# EAGLE design rekick001 (EAGLE 4.16)

## Sheet 1 of 2
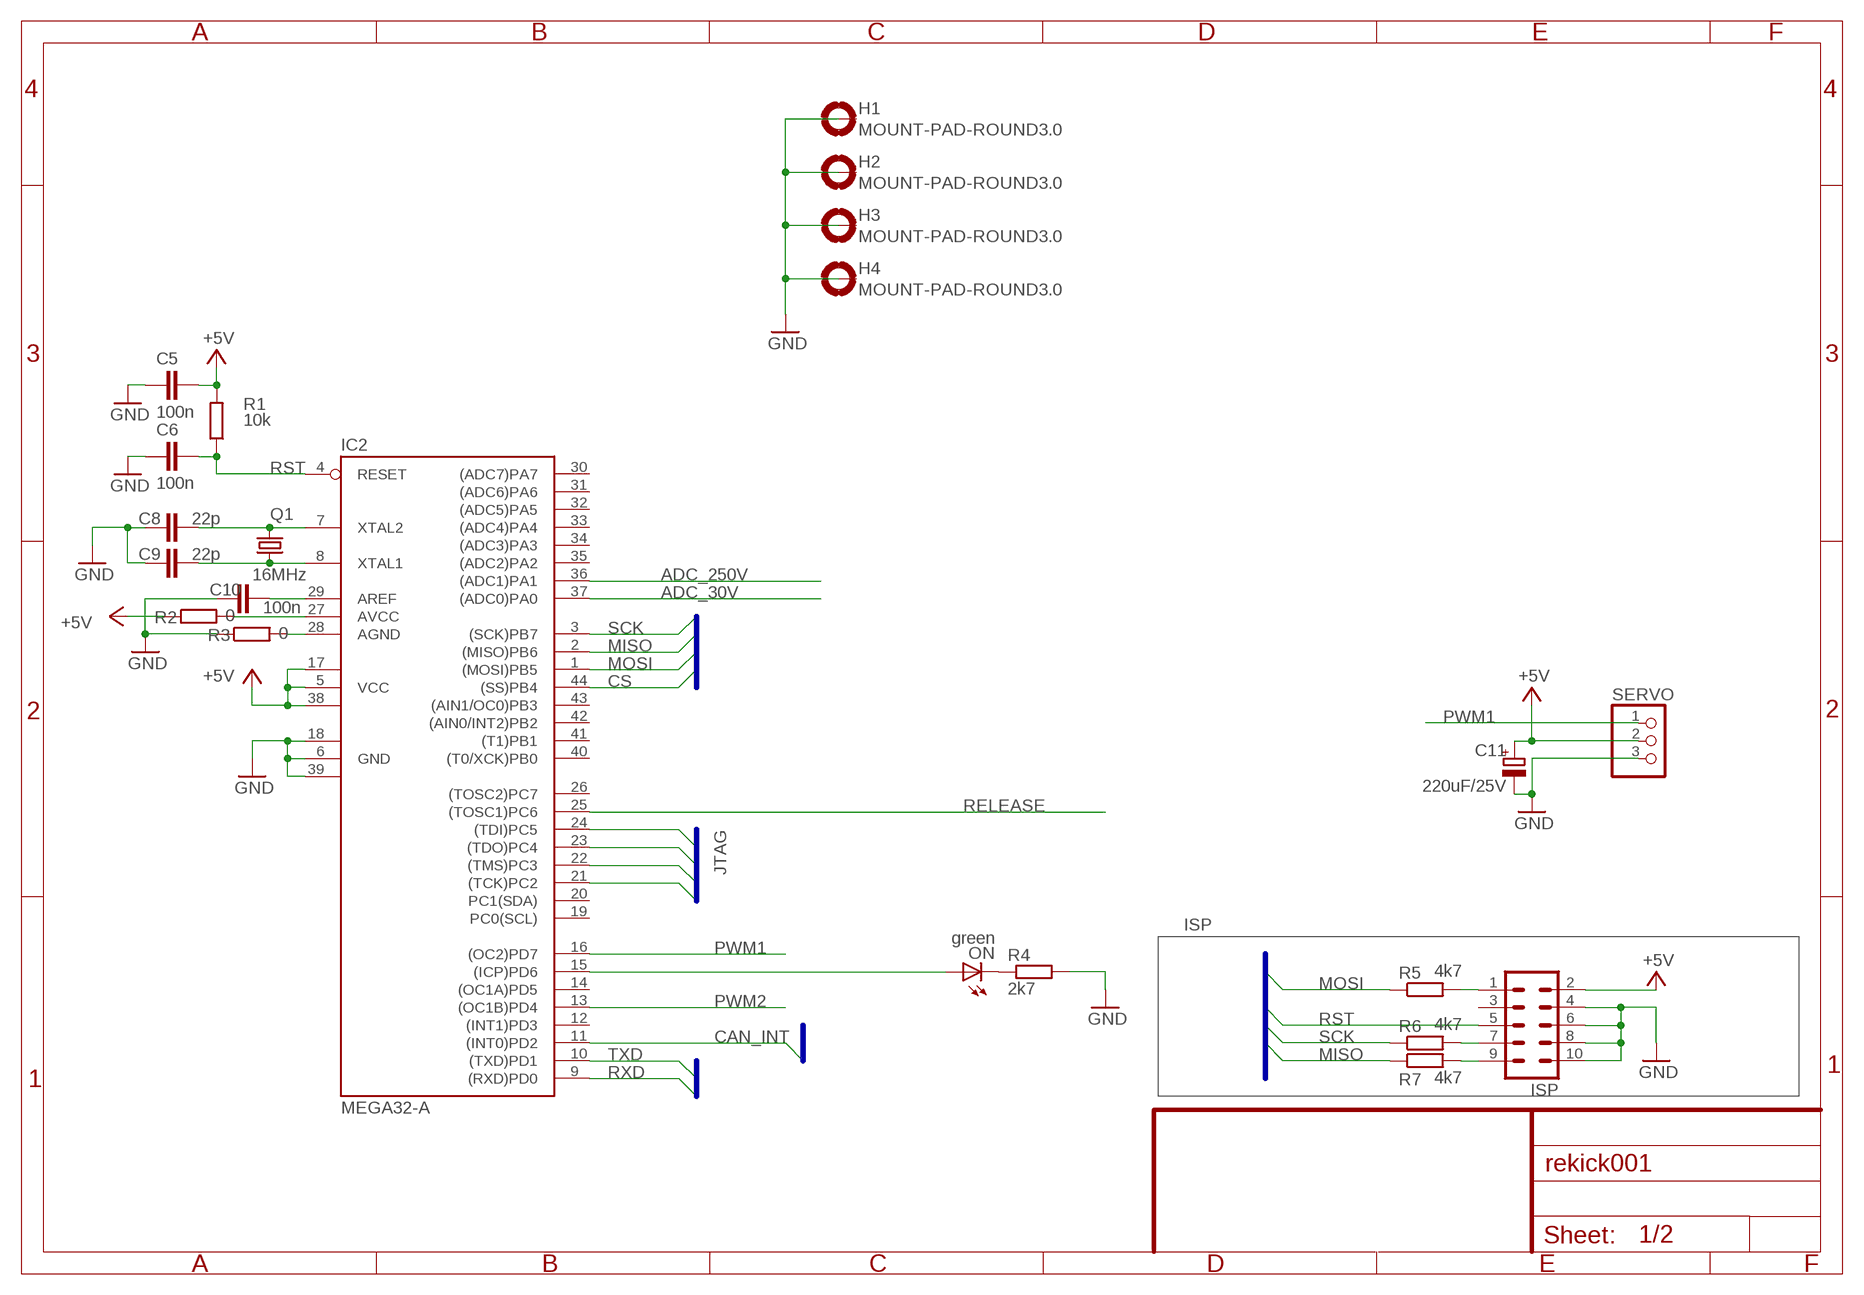
[diagram p0: schematic, sheet 1]

### Parts
C5  100n  C-EUC0603  [C0603]
C6  100n  C-EUC0603  [C0603]
C8  22p  C-EUC0603  [C0603]
C9  22p  C-EUC0603  [C0603]
C10  100n  C-EUC0603  [C0603]
C11  220uF/25V  CPOL-EUE3.5-8  [E3,5-8]
H1  MOUNT-PAD-ROUND3.0  [3,0-PAD]
H2  MOUNT-PAD-ROUND3.0  [3,0-PAD]
H3  MOUNT-PAD-ROUND3.0  [3,0-PAD]
H4  MOUNT-PAD-ROUND3.0  [3,0-PAD]
IC2  MEGA32-A  [TQFP44]
ISP  MA05-2  [MA05-2]
ON  green  LED3MM  [LED3MM]
Q1  16MHz  CRYSTALHC49S  [HC49/S]
R1  10k  R-EU_R0805  [R0805]
R2  0  R-EU_R0805  [R0805]
R3  0  R-EU_R0805  [R0805]
R4  2k7  R-EU_R0805  [R0805]
R5  4k7  R-EU_R0805  [R0805]
R6  4k7  R-EU_R0805  [R0805]
R7  4k7  R-EU_R0805  [R0805]
SERVO  PINHD-1X3  [1X03]

### Nets
+5V [Power]: C5.2 C11.+ IC2.5(VCC) IC2.17(VCC1) IC2.38(VCC2) ISP.2 R1.2 R2.1 SERVO.2 ; also sheet 2
ADC_30V: IC2.37((ADC0)PA0)
ADC_250V: IC2.36((ADC1)PA1)
CAN_INT: IC2.11((INT0)PD2) ; also sheet 2
CS: IC2.44((SS)PB4) ; also sheet 2
GND [Power]: C5.1 C6.1 C8.1 C9.2 C10.1 C11.- H1.B3,0(MOUNT) H2.B3,0(MOUNT) H3.B3,0(MOUNT) H4.B3,0(MOUNT) IC2.6(GND) IC2.18(GND1) IC2.39(GND2) ISP.4 ISP.6 ISP.8 ISP.10 R3.1 R4.2 SERVO.3 ; also sheet 2
MISO: IC2.2((MISO)PB6) R7.1 ; also sheet 2
MOSI: IC2.1((MOSI)PB5) R5.1 ; also sheet 2
N$1: IC2.15((ICP)PD6) ON.A
N$2: C10.2 IC2.29(AREF)
N$3: IC2.27(AVCC) R2.2
N$4: C9.1 IC2.8(XTAL1) Q1.1
N$5: C8.2 IC2.7(XTAL2) Q1.2
N$6: ISP.1 R5.2
N$7: IC2.28(AGND) R3.2
N$8: ISP.7 R6.2
N$9: ISP.9 R7.2
N$31: ON.K(C) R4.1
PWM1: IC2.16((OC2)PD7) SERVO.1
PWM2: IC2.13((OC1B)PD4)
RELEASE: IC2.25((TOSC1)PC6) ; also sheet 2
RST: C6.2 IC2.4(RESET) ISP.5 R1.1 ; also sheet 2
RXD: IC2.9((RXD)PD0)
SCK: IC2.3((SCK)PB7) R6.1 ; also sheet 2
TCK: IC2.21((TCK)PC2)
TDI: IC2.24((TDI)PC5)
TDO: IC2.23((TDO)PC4)
TMS: IC2.22((TMS)PC3)
TXD: IC2.10((TXD)PD1)
Unconnected: IC2.12((INT1)PD3) IC2.14((OC1A)PD5) IC2.19(PC0(SCL)) IC2.20(PC1(SDA)) IC2.26((TOSC2)PC7) IC2.30((ADC7)PA7) IC2.31((ADC6)PA6) IC2.32((ADC5)PA5) IC2.33((ADC4)PA4) IC2.34((ADC3)PA3) IC2.35((ADC2)PA2) IC2.40((T0/XCK)PB0) IC2.41((T1)PB1) IC2.42((AIN0/INT2)PB2) IC2.43((AIN1/OC0)PB3) ISP.3

### Buses
MISO,MOSI,SCK,RST
CS,MOSI,MISO,SCK
RXD,TXD
TDI,TDO,TMS,TCK
CAN_INT

### Notes on the sheet
- JTAG
- ISP

## Sheet 2 of 2
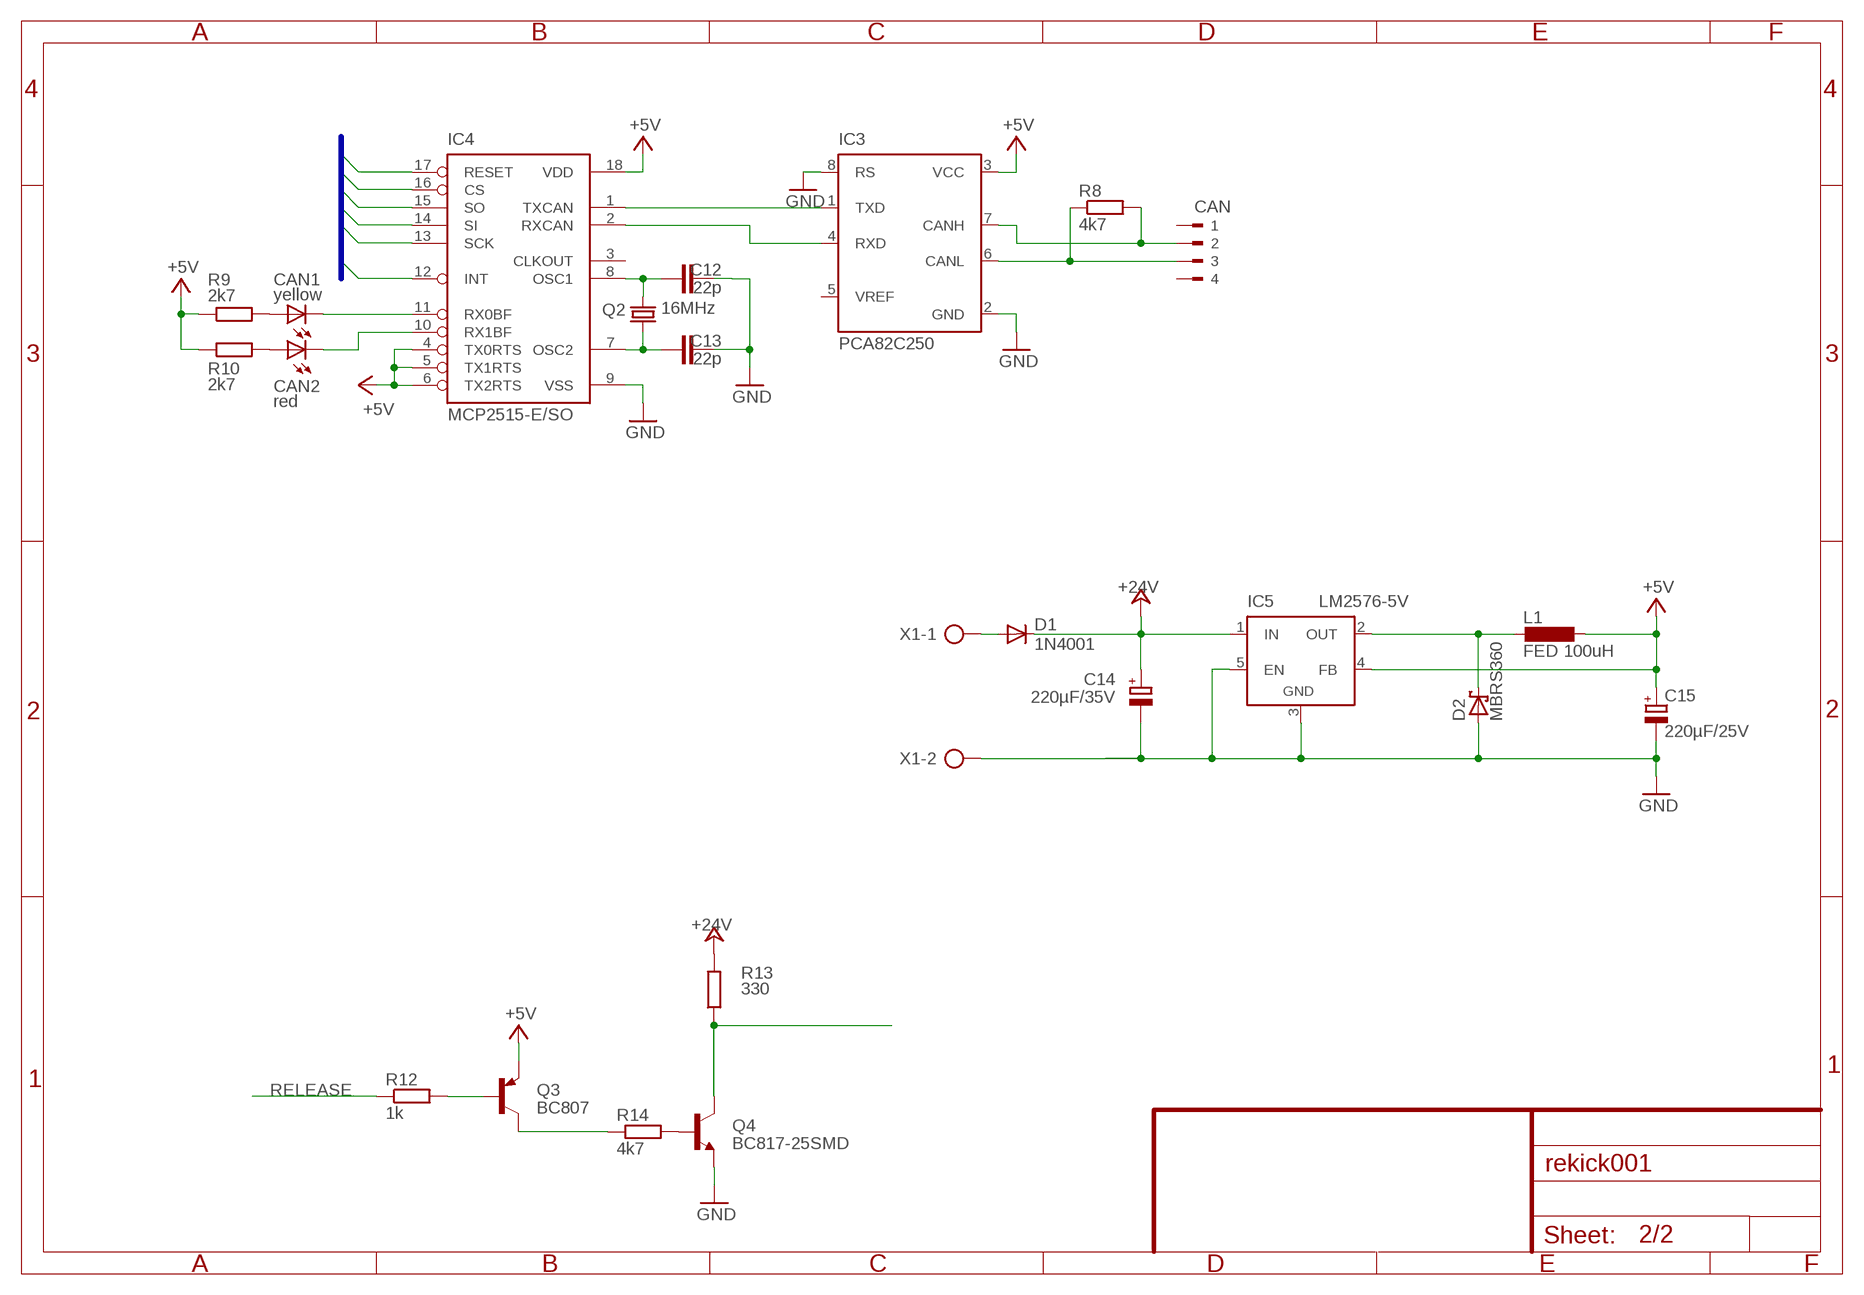
[diagram p1: schematic, sheet 2]

### Parts
C12  22p  C-EUC0603  [C0603]
C13  22p  C-EUC0603  [C0603]
C14  220µF/35V  CPOL-EUE5-10.5  [E5-10,5]
C15  220µF/25V  CPOL-EUE3.5-10  [E3,5-10]
CAN  90-4  [90-4]
CAN1  yellow  LED3MM  [LED3MM]
CAN2  red  LED3MM  [LED3MM]
D1  1N4001  1N4004  [DO41-10]
D2  MBRS360  SCHOTTKY-DIODESMD  [SMB]
IC3  PCA82C250  [DIL08]
IC4  MCP2515-E/SO  [SO18L]
IC5  LM2576-5V  LM2596TV  [TO220-51]
L1  FED 100uH  L-EUTJ4-U1  [TJ4-U1]
Q2  16MHz  CRYSTALHC49U-V  [HC49U-V]
Q3  BC807  BC807-40SMD  [SOT23-BEC]
Q4  BC817-25SMD  [SOT23-BEC]
R8  4k7  R-EU_R0805  [R0805]
R9  2k7  R-EU_R0805  [R0805]
R10  2k7  R-EU_R0805  [R0805]
R12  1k  R-EU_R0805  [R0805]
R13  330  R-EU_R0805  [R0805]
R14  4k7  R-EU_R0805  [R0805]
X1  AK500/2-H  [AK500/2-H]

### Nets
+5V [Power]: C15.+ IC3.3(VCC) IC4.4(TX0RTS) IC4.5(TX1RTS) IC4.6(TX2RTS) IC4.18(VDD) IC5.4(FB) L1.1 Q3.E R9.1 R10.1 ; also sheet 1
+24V [Power]: C14.+ D1.C IC5.1(IN) R13.2
CAN_INT: IC4.12(INT) ; also sheet 1
CS: IC4.16(CS) ; also sheet 1
GND [Power]: C12.2 C13.2 C14.- C15.- D2.A IC3.2(GND) IC3.8(RS) IC4.9(VSS) IC5.3(GND) IC5.5(EN) Q4.E X1.2 ; also sheet 1
MISO: IC4.15(SO) ; also sheet 1
MOSI: IC4.14(SI) ; also sheet 1
N$10: CAN1.A R9.2
N$11: CAN2.A R10.2
N$12: IC3.1(TXD) IC4.1(TXCAN)
N$21: Q3.C R14.1
N$22: IC3.4(RXD) IC4.2(RXCAN)
N$23: Q4.B R14.2
N$24: CAN.3 IC3.6(CANL) R8.1
N$25: Q3.B R12.2
N$26: D1.A X1.1
N$27: CAN1.K(C) IC4.11(RX0BF)
N$29: Q4.C R13.1
N$30 [Power]: D2.C IC5.2(OUT) L1.2
N$38: CAN2.K(C) IC4.10(RX1BF)
N$53: C13.1 IC4.7(OSC2) Q2.1
N$54: C12.1 IC4.8(OSC1) Q2.2
N$59: CAN.2 IC3.7(CANH) R8.2
RELEASE: R12.1 ; also sheet 1
RST: IC4.17(RESET) ; also sheet 1
SCK: IC4.13(SCK) ; also sheet 1
Unconnected: CAN.1 CAN.4 IC3.5(VREF) IC4.3(CLKOUT)

### Buses
SCK,MOSI,MISO,RST,CS,CAN_INT

## Library data of the parts
C5 C6 C8-C10 C12 C13 = rcl:C-EU: CAPACITOR, European symbol
C11 C14 C15 = rcl:CPOL-EU: POLARIZED CAPACITOR, European symbol
CAN = con-weidmueller-sl35:90-4: WEIDMUELLER CLAMP CONNECTOR
CAN1 CAN2 ON = led:LED: LED OSRAM: - CHIPLED LG R971, LG N971, LY N971, LG Q971, LY Q971, LO R971, LY R971 LH N974, LH R974 LS Q976, LO Q976, LY Q976 LO Q996 - Hyper CHIPLED LW Q18S LB Q993, LB Q99A, LB R99A - SideLED LS A670, LO A670, LY A670, LG A670, LP A670 LB A673, LV A673, LT A673, LW A673 LH A674 LY A675 LS A676, LA A676, LO A676, LY A676, LW A676 LS A679, LY A679, LG A679 - Hyper Micro SIDELED® LS Y876, LA Y876, LO Y876, LY Y876 LT Y87S - SmartLED LW L88C, LW L88S LB L89C, LB L89S, LG L890 LS L89K, LO L89K, LY L89K LS L896, LA L896, LO L896, LY L896 - TOPLED LS T670, LO T670, LY T670, LG T670, LP T670 LSG T670, LSP T670, LSY T670, LOP T670, LYG T670 LG T671, LOG T671, LSG T671 LB T673, LV T673, LT T673, LW T673 LH T674 LS T676, LA T676, LO T676, LY T676, LB T676, LH T676, LSB T676, LW T676 LB T67C, LV T67C, LT T67C, LS T67K, LO T67K, LY T67K, LW E67C LS E67B, LA E67B, LO E67B, LY E67B, LB E67C, LV E67C, LT E67C LW T67C LS T679, LY T679, LG T679 LS T770, LO T770, LY T770, LG T770, LP T770 LB T773, LV T773, LT T773, LW T773 LH T774 LS E675, LA E675, LY E675, LS T675 LS T776, LA T776, LO T776, LY T776, LB T776 LHGB T686 LT T68C, LB T68C - Hyper Mini TOPLED® LB M676 - Mini TOPLED Santana® LG M470 LS M47K, LO M47K, LY M47K Source: http://www.osram.convergy.de - LUMILED® LXK2-PW12-R00, LXK2-PW12-S00, LXK2-PW14-U00, LXK2-PW14-V00 LXK2-PM12-R00, LXK2-PM12-S00, LXK2-PM14-U00 LXK2-PE12-Q00, LXK2-PE12-R00, LXK2-PE12-S00, LXK2-PE14-T00, LXK2-PE14-U00 LXK2-PB12-K00, LXK2-PB12-L00, LXK2-PB12-M00, LXK2-PB14-N00, LXK2-PB14-P00, LXK2-PB14-Q00 LXK2-PR12-L00, LXK2-PR12-M00, LXK2-PR14-Q00, LXK2-PR14-R00 LXK2-PD12-Q00, LXK2-PD12-R00, LXK2-PD12-S00 LXK2-PH12-R00, LXK2-PH12-S00 LXK2-PL12-P00, LXK2-PL12-Q00, LXK2-PL12-R00 Source: www.luxeon.com
D1 = diode:1N4004: DIODE general purpose rectifier, 1 A
D2 = diode:SCHOTTKY-DIODE: Schottky Diode
H1-H4 = holes:MOUNT-PAD-ROUND: MOUNTING PAD, round
IC2 = atmel:MEGA32: MICROCONTROLLER 32 Kbytes FLASH 2 Kbytes SRAM 1 Kbytes EEPROM USART 8-channel 10 bit ADC Source: www.atmel.com .. doc2503.pdf
IC3 = micro-philips:PCA82C250: CAN CONTROLLER INTERFACE
IC4 = mcp2515:MCP2515
IC5 = linear:LM2596T: STEP-DOWN VOLTAGE REGULATOR
ISP = con-lstb:MA05-2: PIN HEADER
L1 = rcl:L-EU: INDUCTOR, European symbol
Q1 Q2 = crystal:CRYSTAL: CRYSTAL
Q3 = transistor-pnp:BC807*: PNP Transistror
Q4 = transistor-npn:BC817*: NPN Transistor
R1-R10 R12-R14 = rcl:R-EU_: RESISTOR, European symbol
SERVO = pinhead:PINHD-1X3: PIN HEADER
X1 = con-ptr500:AK500/2-H: CONNECTOR Aug. 2004 / PTR Meßtechnik: Die Bezeichnung der Serie AK505 wurde geändert. Es handelt sich hierbei um AK500 in horizontaler Ausführung.

## Net classes
1 Power: width 0.406 mm
2 High Power: width 2 mm

## Board
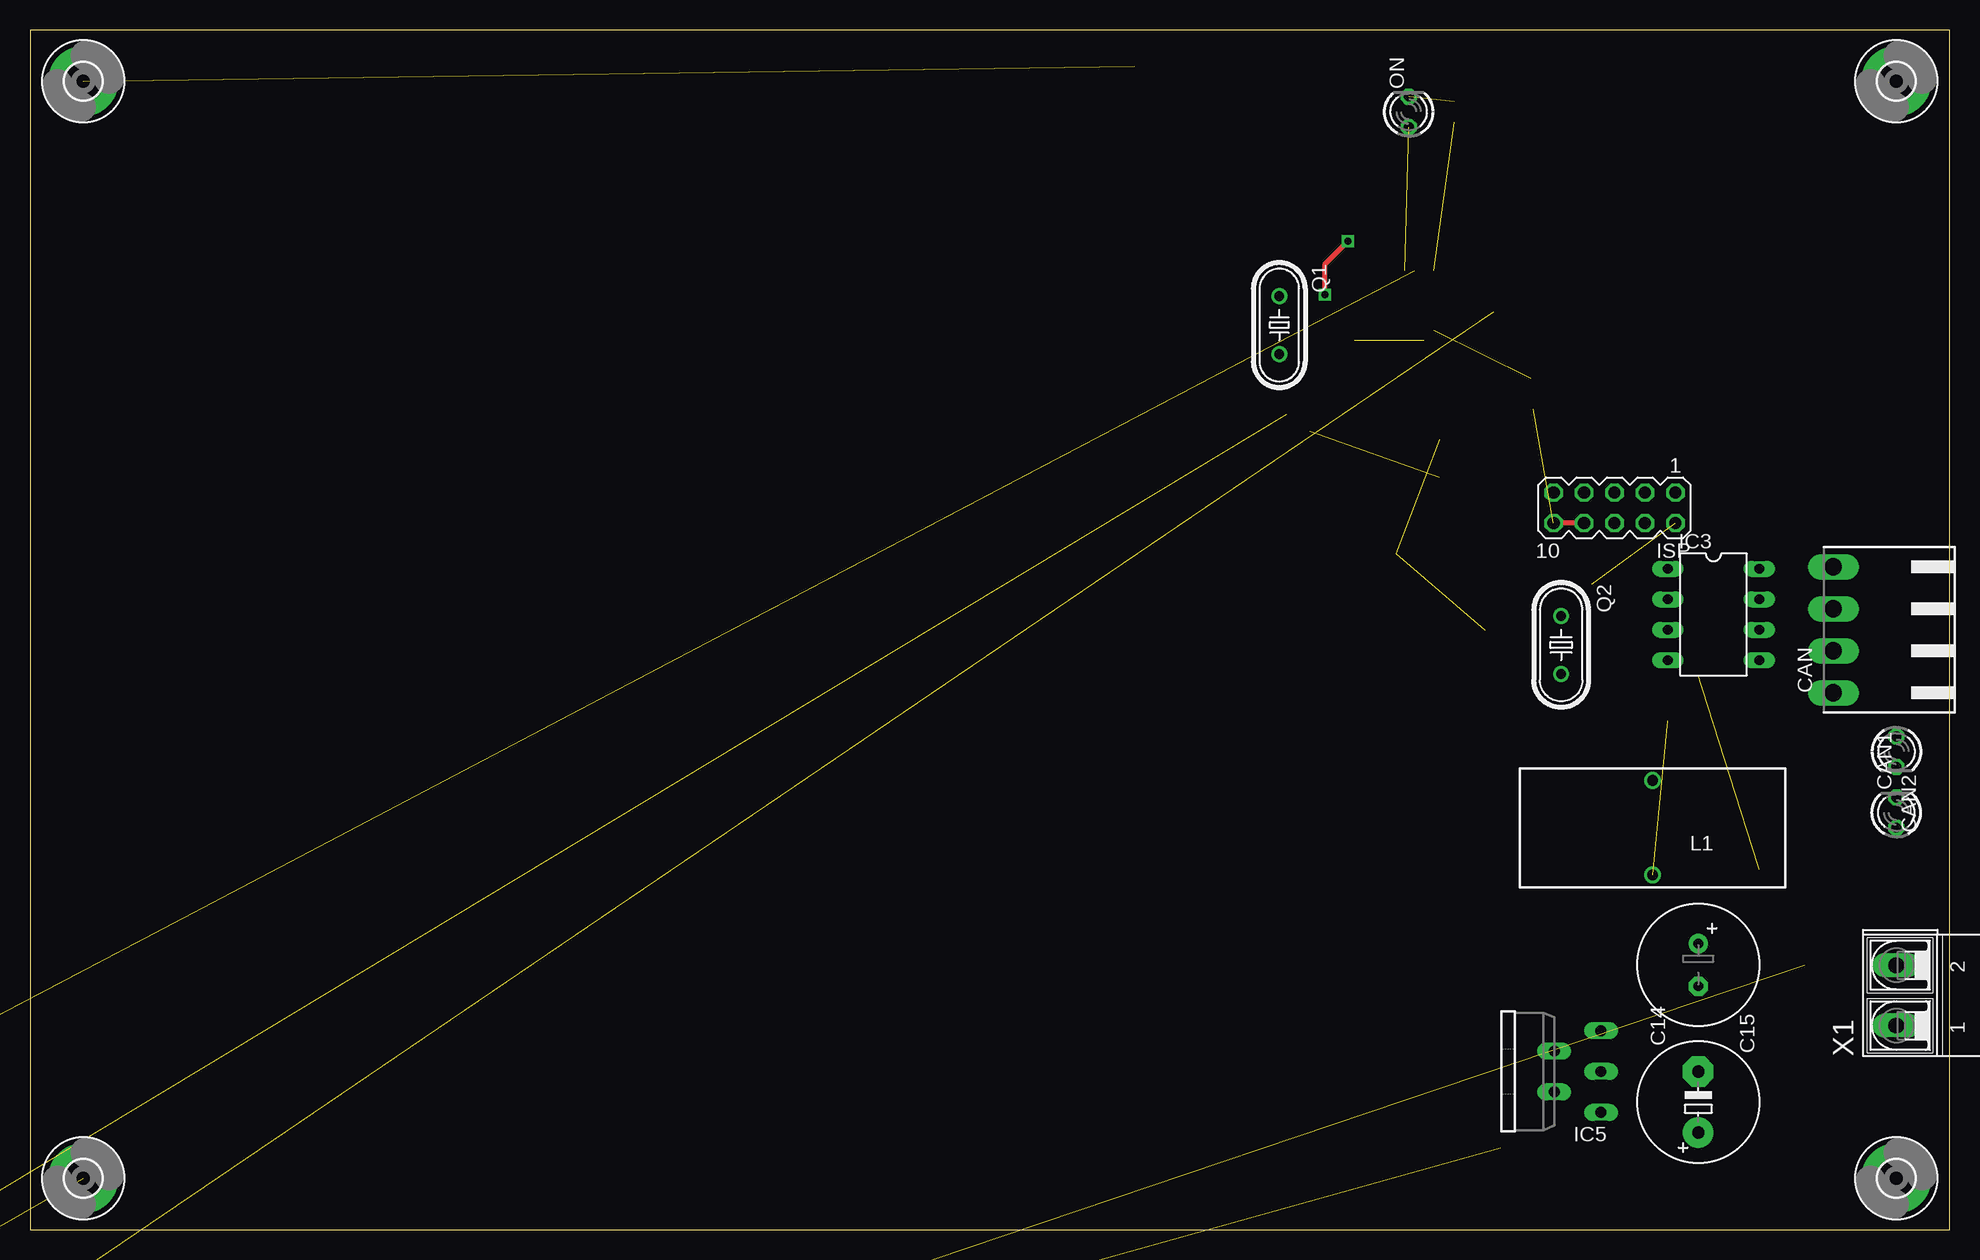
[diagram p2: board, top side]
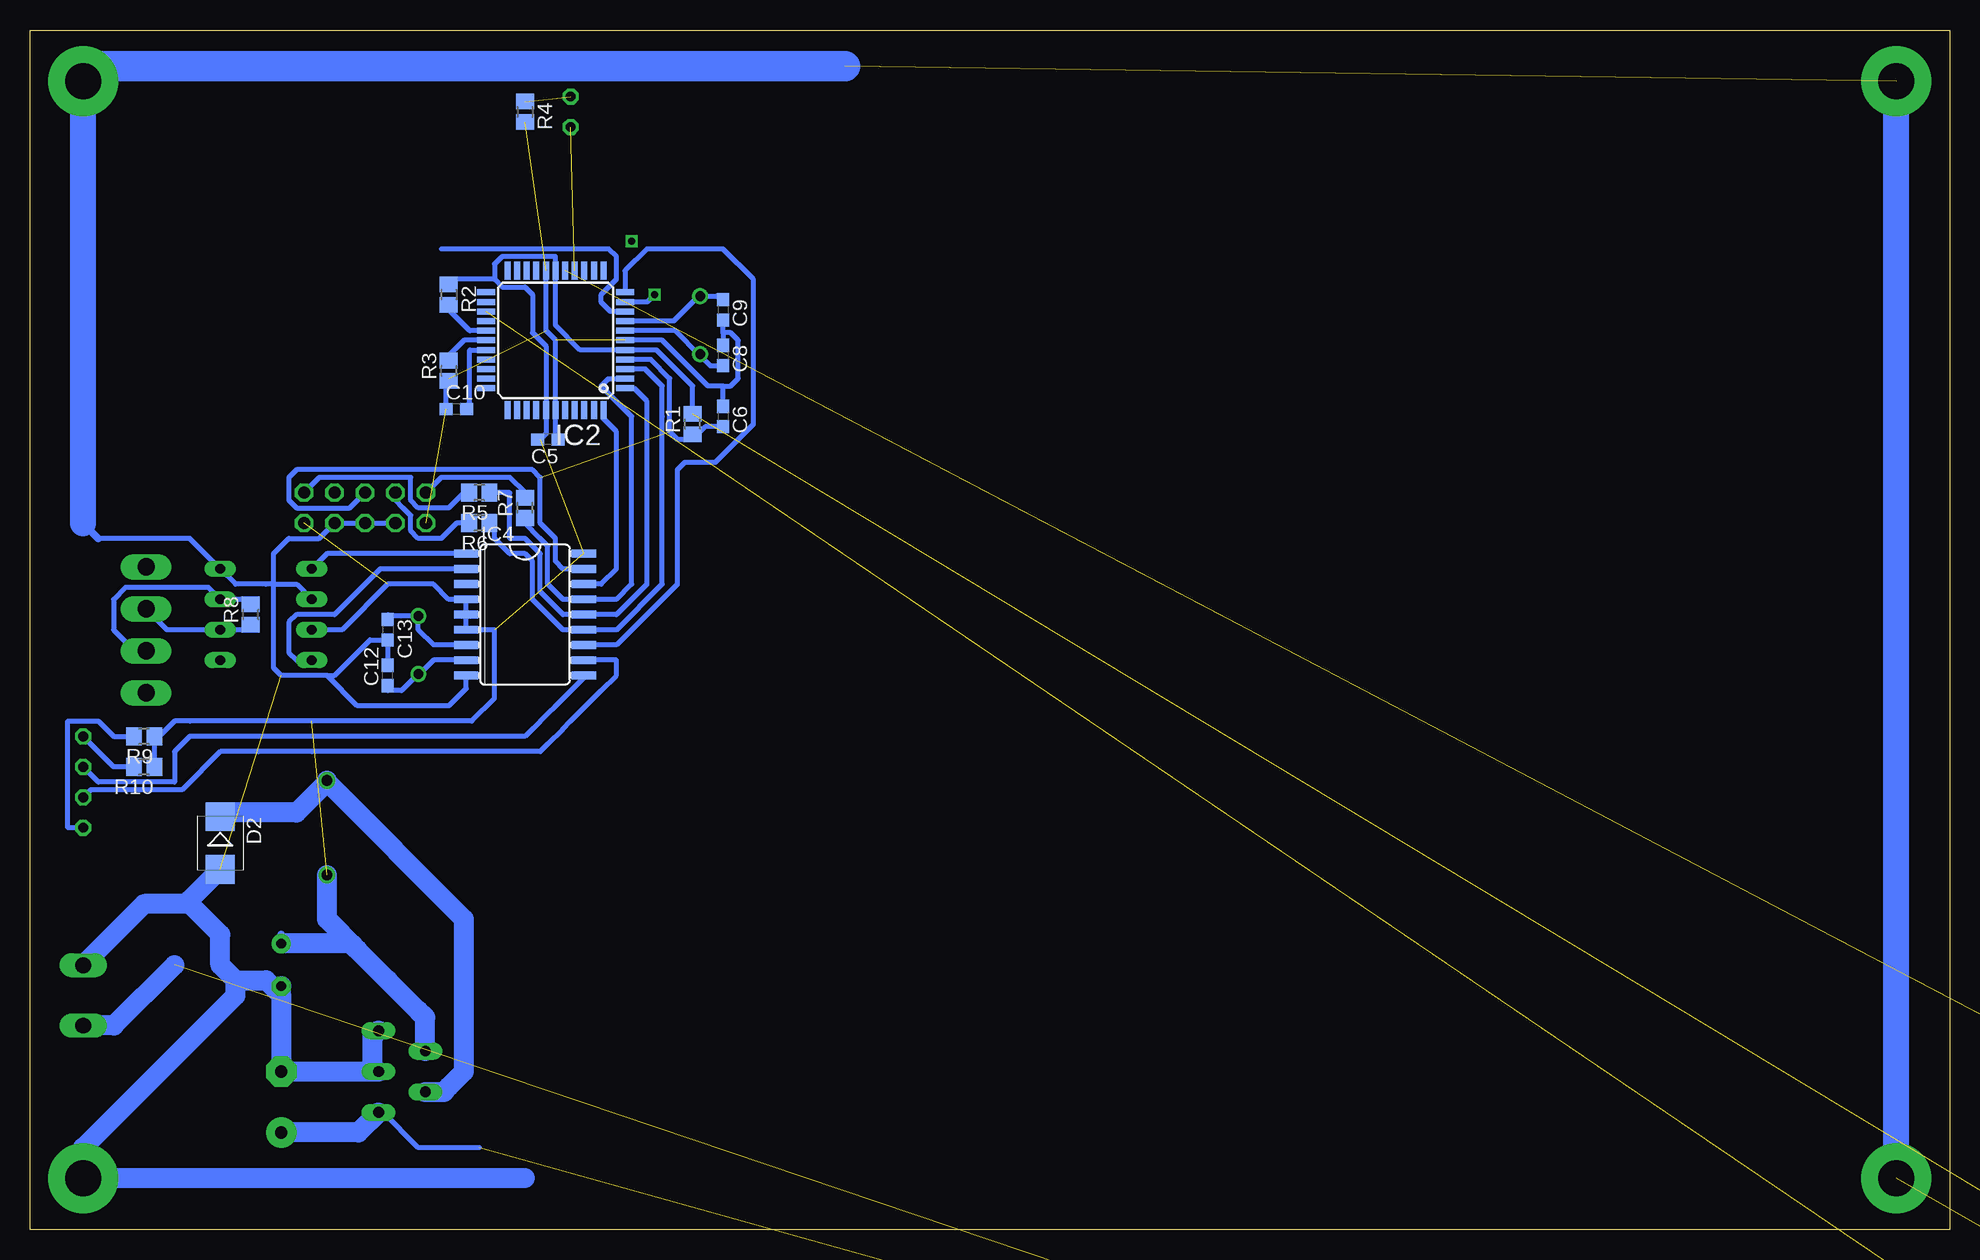
[diagram p3: board, bottom side, seen from below]

Size 160 x 100 mm. Coordinates in mm from the lower left corner, seen from the top.
Outline: 0,0 160,0 160,100 0,100 0,0
Copper layers (1*16): Top 0.035mm / dielectric 1.5mm / Bottom 0.035mm
Design rules "olimex_8mils": minimum track width 10mil, minimum drill 24mil, track to track 8mil, track to pad 8mil, pad to pad 8mil, via to via 8mil, smd to smd 8mil, copper to edge 40mil, drill to drill 10mil, minimum pad ring 10mil, minimum via ring 8mil, stop-mask expansion 0mil, vias tented up to drill 0mil, thermal gap 10mil

### Footprints (pad centres in the part's own frame; a part is rotated, then mirrored left to right if it is on the bottom)
C0603 = smd 1.1 x 1: 1 -0.85,0; 2 0.85,0
E3,5-8 = drill 0.813 pad 1.6 round: + -1.778,0 | drill 0.813 pad 1.6 octagon: - 1.778,0
E5-10,5 = drill 1.016 pad 2.54 round: + -2.54,0 | drill 1.016 pad 2.54 octagon: - 2.54,0
E3,5-10 = drill 0.813 pad 1.6 round: + -1.778,0 | drill 0.813 pad 1.6 octagon: - 1.778,0
90-4 = drill 1.422 long: 1 -5.25,5.25; 2 -1.75,5.25; 3 1.75,5.25; 4 5.25,5.25
LED3MM = drill 0.813 octagon: A -1.27,0; K 1.27,0
DO41-10 = drill 1.118 round: A 5.08,0; C -5.08,0
SMB = smd 2.4 x 2.4: A 2.2,0; C -2.2,0
3,0-PAD = drill 3 pad 5.842 round: B3,0 0,0
TQFP44 = smd 1.5 x 0.5: 1 -5.8,4; 2 -5.8,3.2; 3 -5.8,2.4; 4 -5.8,1.6; 5 -5.8,0.8; 6 -5.8,0; 7 -5.8,-0.8; 8 -5.8,-1.6; 9 -5.8,-2.4; 10 -5.8,-3.2; 11 -5.8,-4; 23 5.8,-4; 24 5.8,-3.2; 25 5.8,-2.4; 26 5.8,-1.6; 27 5.8,-0.8; 28 5.8,0; 29 5.8,0.8; 30 5.8,1.6; 31 5.8,2.4; 32 5.8,3.2; 33 5.8,4 | smd 0.5 x 1.5: 12 -4,-5.8; 13 -3.2,-5.8; 14 -2.4,-5.8; 15 -1.6,-5.8; 16 -0.8,-5.8; 17 0,-5.8; 18 0.8,-5.8; 19 1.6,-5.8; 20 2.4,-5.8; 21 3.2,-5.8; 22 4,-5.8; 34 4,5.8; 35 3.2,5.8; 36 2.4,5.8; 37 1.6,5.8; 38 0.8,5.8; 39 0,5.8; 40 -0.8,5.8; 41 -1.6,5.8; 42 -2.4,5.8; 43 -3.2,5.8; 44 -4,5.8
DIL08 = drill 0.813 long: 1 -3.81,-3.81; 2 -1.27,-3.81; 3 1.27,-3.81; 4 3.81,-3.81; 5 3.81,3.81; 6 1.27,3.81; 7 -1.27,3.81; 8 -3.81,3.81
SO18L = smd 0.66 x 2.032: 1 -5.08,-4.902; 2 -3.81,-4.902; 3 -2.54,-4.902; 4 -1.27,-4.902; 5 0,-4.902; 6 1.27,-4.902; 7 2.54,-4.902; 8 3.81,-4.902; 9 5.08,-4.902; 10 5.08,4.902; 11 3.81,4.902; 12 2.54,4.902; 13 1.27,4.902; 14 0,4.902; 15 -1.27,4.902; 16 -2.54,4.902; 17 -3.81,4.902; 18 -5.08,4.902
TO220-51 = drill 0.9 long: 1 -3.4,-8.4; 2 -1.7,-4.5; 3 0,-8.4; 4 1.7,-4.5; 5 3.4,-8.4
MA05-2 = drill 1.016 octagon: 1 -5.08,-1.27; 2 -5.08,1.27; 3 -2.54,-1.27; 4 -2.54,1.27; 5 0,-1.27; 6 0,1.27; 7 2.54,-1.27; 8 2.54,1.27; 9 5.08,-1.27; 10 5.08,1.27
TJ4-U1 = drill 0.9 round: 1 -3.935,0; 2 3.935,0
HC49/S = drill 0.813 round: 1 -2.413,0; 2 2.413,0
HC49U-V = drill 0.813 round: 1 -2.413,0; 2 2.413,0
SOT23-BEC = smd 1 x 1.4: B -0.95,-1.1; C 0,1.1; E 0.95,-1.1
R0805 = smd 1.3 x 1.5: 1 -0.85,0; 2 0.85,0
1X03 = drill 1.016 long: 1 -2.54,0; 2 0,0; 3 2.54,0
AK500/2-H = drill 1.321 long: 1 -2.515,0; 2 2.515,0

### Placement (x,y rotation side)
C5  116.83,65.88 180 bottom
C6  102.23,67.78 270 bottom
C8  102.23,72.86 270 bottom
C9  102.23,76.67 270 bottom
C10  124.45,68.41 0 bottom
C11  -34.93,-17.31 0 top  (outside the outline)
C12  130.17,46.19 90 bottom
C13  130.17,50 270 bottom
C14  139.06,10.63 90 top
C15  139.06,22.06 270 top
CAN  155.57,50 90 top
CAN1  155.57,34.76 90 top
CAN2  155.57,39.84 270 top
D1  -45.09,-41.44 0 top  (outside the outline)
D2  144.14,32.22 270 bottom
H1  4.44,95.72 0 top
H2  4.44,4.28 0 top
H3  155.57,95.72 0 top
H4  155.57,4.28 0 top
IC2  116.2,74.13 180 bottom
IC3  140.33,51.27 270 top
IC4  118.74,51.27 270 bottom
IC5  122.55,13.17 90 top
ISP  132.07,60.16 180 top
L1  135.25,33.49 90 top
ON  114.93,93.18 90 top
Q1  104.13,75.4 270 top
Q2  127.63,48.73 270 top
Q3  -40.64,-26.2 0 top  (outside the outline)
Q4  -31.12,-26.2 0 top  (outside the outline)
R1  104.77,67.14 90 bottom
R2  125.09,77.94 270 bottom
R3  125.09,71.59 90 bottom
R4  118.74,93.18 270 bottom
R5  122.55,61.43 180 bottom
R6  122.55,58.89 180 bottom
R7  118.74,60.16 90 bottom
R8  141.6,51.27 90 bottom
R9  150.49,41.11 180 bottom
R10  150.49,38.57 180 bottom
R12  -40.64,-34.45 0 top  (outside the outline)
R13  -50.17,-56.68 0 top  (outside the outline)
R14  -31.75,-34.45 0 top  (outside the outline)
SERVO  -50.17,-8.42 0 top  (outside the outline)
X1  155.57,19.52 90 top

### Tracks (layer width: path | path; a pad name or v marks a point on that pad's centre or on a via)
+5V  (7 unrouted)
  Bottom 0.406: 123.82,52.54 IC4.4 | 123.82,52.54 123.64,52.36 IC4.5 123.82,51.27 123.64,51.09 IC4.6 123.82,50 121.28,50 121.28,44.28 123.19,42.38 136.52,42.38 146.68,42.38 147.95,42.38 149.22,41.11 | 123.82,52.54 IC4.4 | 123.82,52.54 IC4.4 | IC3.3 133.98,50 130.17,53.81 126.36,53.81 125.09,52.54 123.82,52.54 | 123.82,52.54 IC4.4 | 116.2,79.84 116.2,75.4 114.13,73.33 IC2.5 107.78,73.33 104.77,70.32 104.77,68.41 R1.2 | 116.2,79.84 IC2.17 116.2,79.84 | 149.22,41.11 R9.1 149.22,41.11 | R10.1 149.64,40.69 149.22,41.11 | 121.28,79.21 120.64,78.58 118.74,78.58 118.1,77.94 118.1,74.77 117,73.66 IC2.38 117,66.34 117.47,65.88 C5.2 | 121.28,79.21 121.28,80.48 120.64,81.11 116.2,81.11 116.2,79.84 | R2.1 124.67,79.21 121.28,79.21
  Bottom 0.61: C15.+ 139.06,24.6
  Bottom 1.676: C15.+ 133.22,23.84 132.71,23.33 | 132.71,23.33 130.17,20.79 127.63,18.25 127.05,17.67 IC5.4 | L1.1 135.25,25.87 132.71,23.33
+24V  (2 unrouted)
  Bottom 0.406: 130.58,9.77 127.63,6.82 122.55,6.82
  Bottom 0.61: 130.58,9.77 IC5.1
  Bottom 1.676: IC5.1 132.63,8.09 C14.+
CAN_INT
  Bottom 0.406: IC4.12 111.12,48.73 106.04,53.81 106.04,63.34 105.41,63.97 104.13,63.97 102.86,63.97 99.69,67.14 99.69,79.21 102.23,81.75 108.58,81.75 110.4,79.93 IC2.11
CS
  Bottom 0.406: IC4.16 112.39,53.81 111.12,55.08 111.12,63.97 111.12,66.51 112.2,67.59 IC2.44
GND  (9 unrouted)
  Top 0.406: ISP.8 ISP.10
  Bottom 0.406: IC3.2 137.79,53.81 139.69,53.81 | 139.69,53.81 140.33,53.81 142.87,53.81 IC3.8 146.68,57.62 154.3,57.62 | C12.2 130.17,48.73 C13.2 131.66,49.15 134.62,46.19 135.25,46.19 | 135.25,46.19 139.06,46.19 139.69,46.82 139.69,53.81 | IC4.9 123.64,45.1 125.09,43.65 132.71,43.65 135.25,46.19 | IC2.18 117,74.93 116.2,74.13 IC2.39 116.2,65.88 C5.1 | C9.2 102.23,76.03 102.23,74.77 | 102.23,74.77 C8.1 | IC2.6 107.31,74.13 103.5,70.32 102.23,70.32 | 102.23,70.32 101.59,70.32 100.96,70.95 100.96,74.13 101.59,74.77 102.23,74.77 | ISP.8 ISP.6 ISP.4 135.88,57.62 138.42,57.62 139.69,56.35 139.69,53.81 | C6.1 102.23,70.32 | 155.16,68.64 154.94,68.41 154.71,68.64 | R3.1 125.09,70.95 125.3,70.74 C10.1
  Bottom 0.61: 155.57,69.05 155.16,68.64 | 154.3,57.62 155.57,58.89
  Bottom 1.676: 139.06,19.52 C14.- 131.44,13.17 | 139.06,19.52 C15.- | 142.87,20.79 144.14,22.06 144.14,24.6 146.68,27.14 | 142.87,20.79 140.33,20.79 139.06,19.52 | 131.44,13.17 IC5.3 | IC5.5 131.44,16.08 131.44,13.17 | 142.87,20.79 142.87,19.52 155.57,6.82 H4.B3,0 120.01,4.28 118.74,4.28 | X1.2 155.57,22.06 150.49,27.14 146.68,27.14 | D2.A 146.68,27.48 146.68,27.14
  Bottom 2.184: H2.B3,0 4.44,22.06 4.44,50 4.44,55.08 4.44,88.1 H1.B3,0 | H3.B3,0 155.57,81.75 155.57,69.05 155.57,66.51 155.57,58.89
  Bottom 2.54: 92.07,96.99 154.3,96.99 H3.B3,0
MISO
  Bottom 0.406: IC2.2 111.78,70.93 112.39,70.32 109.85,67.78 109.85,53.81 111.12,52.54 IC4.15 115.56,52.54 116.83,53.81 116.83,56.98 117.47,57.62 118.74,58.89 R7.1
MOSI
  Bottom 0.406: 113.66,51.27 111.12,51.27 108.58,53.81 108.58,65.24 108.58,69.05 109.66,70.13 IC2.1 | 113.66,51.27 IC4.14 113.66,51.27 | 113.66,51.27 115.56,51.27 117.47,53.17 117.47,56.35 118.74,57.62 120.01,57.62 120.01,61.43 121.28,61.43 R5.1
N$1  (1 unrouted)
N$2
  Bottom 0.406: IC2.29 123.35,73.33 123.35,68.89 123.82,68.41 C10.2
N$3
  Bottom 0.406: R2.2 125.09,76.67 123.35,74.93 IC2.27
N$4
  Bottom 0.406: C9.1 102.23,77.3 102.74,77.81 Q1.1 104.13,77.94 106.34,75.73 IC2.8
N$5
  Bottom 0.406: 104.13,72.86 Q1.2 104.13,72.86 | IC2.7 106.2,74.93 104.13,72.86 | C8.2 103.28,72.01 104.13,72.86
N$6
  Bottom 0.406: R5.2 123.82,61.43 125.09,60.16 127.63,60.16 128.27,60.8 128.27,62.7 135.88,62.7 ISP.1
N$7
  Bottom 0.406: R3.2 125.09,72.86 123.82,74.13 IC2.28
N$8
  Bottom 0.406: R6.2 123.82,58.89 124.45,58.89 125.72,57.62 127.63,57.62 128.27,58.25 128.27,59.52 128.9,60.16 129.53,60.8 ISP.7
N$9
  Bottom 0.406: R7.2 118.74,61.43 120.01,62.7 125.09,62.7 125.72,62.7 ISP.9
N$10
  Bottom 0.406: R9.2 153.03,41.11 154.3,42.38 156.84,42.38 156.84,33.49 CAN1.A
N$11
  Bottom 0.406: R10.2 153.03,38.57 CAN2.A
N$12
  Bottom 0.406: IC4.1 135.25,56.35 IC3.1
N$21  (1 unrouted)
N$22
  Bottom 0.406: IC4.2 130.81,55.08 134.62,51.27 137.79,51.27 138.42,50.63 138.42,48.09 137.79,47.46 IC3.4
N$23  (1 unrouted)
N$24
  Bottom 0.406: CAN.3 148.57,50 IC3.6 141.6,50 R8.1
N$25  (1 unrouted)
N$26  (1 unrouted)
  Bottom 1.676: X1.1 153,17 147.95,22.06
N$27
  Bottom 0.406: IC4.11 113.66,47.46 111.12,47.46 111.12,46.19 112.39,44.92 114.93,42.38 115.56,41.74 116.83,40.48 117.47,39.84 136.52,39.84 140.97,39.84 144.14,39.84 147.31,36.66 154.94,36.66 CAN1.K
N$29  (1 unrouted)
N$30
  Bottom 1.676: IC5.2 125.52,11.47 125.09,11.9 | 125.09,11.9 123.82,13.17 123.82,18.25 123.82,25.87 135.25,37.3 | 125.09,11.9 125.43,11.56 | 135.25,37.3 L1.2 | D2.C 144.14,34.76 137.79,34.76 135.25,37.3
N$31  (1 unrouted)
N$38
  Bottom 0.406: IC4.10 113.66,46.19 116.2,43.65 116.83,43.02 118.1,41.74 118.74,41.11 136.52,41.11 141.6,41.11 145.41,41.11 146.68,41.11 147.95,39.84 147.95,37.3 154.3,37.3 CAN2.K
N$53
  Bottom 0.406: IC4.7 126.36,48.73 127.63,50 Q2.1 | Q2.1 127.63,51.27 Q2.1 | C13.1 130.17,51.27 130.04,51.14 Q2.1
N$54
  Bottom 0.406: IC4.8 126.36,47.46 127.63,46.19 Q2.2 129.03,44.92 130.17,44.92 C12.1
N$59
  Bottom 0.406: CAN.2 151.28,48.25 153.03,50 153.03,52.54 152.04,53.52 151.49,53.52 145.12,53.52 IC3.7 141.6,52.54 R8.2
PWM1  (1 unrouted)
RELEASE  (1 unrouted)
RST  (1 unrouted)
  Bottom 0.406: IC4.17 115.56,55.08 116.2,55.71 116.2,57.62 117.47,58.89 117.47,62.7 118.1,63.34 137.79,63.34 138.42,62.7 138.42,60.8 137.79,60.16 133.34,60.16 ISP.5 | IC2.4 108.25,72.53 106.67,70.95 106.67,66.51 106.04,65.88 104.77,65.88 | 104.77,65.88 R1.1 104.77,65.88 | C6.2 103.71,66.93 104.77,65.88
RXD
  Bottom 0.406: 125.72,81.75 111.75,81.75 111.12,81.11 111.12,79.21 112.39,77.94 112.39,77.3 111.61,76.53 IC2.9
SCK
  Bottom 0.406: IC2.3 108.72,71.73 107.31,70.32 107.31,67.78 107.31,53.81 111.12,50 IC4.13 115.56,50 118.1,52.54 118.1,55.71 118.74,56.35 120.01,56.35 121.28,57.62 121.28,58.89 R6.1
TXD  (via drill 0.6)
  Top 0.406: v107.94,77.94 107.94,80.48 v109.85,82.39
  Bottom 0.406: IC2.10 108.55,77.33 v107.94,77.94